# EAGLE design batsense (EAGLE 4.13)
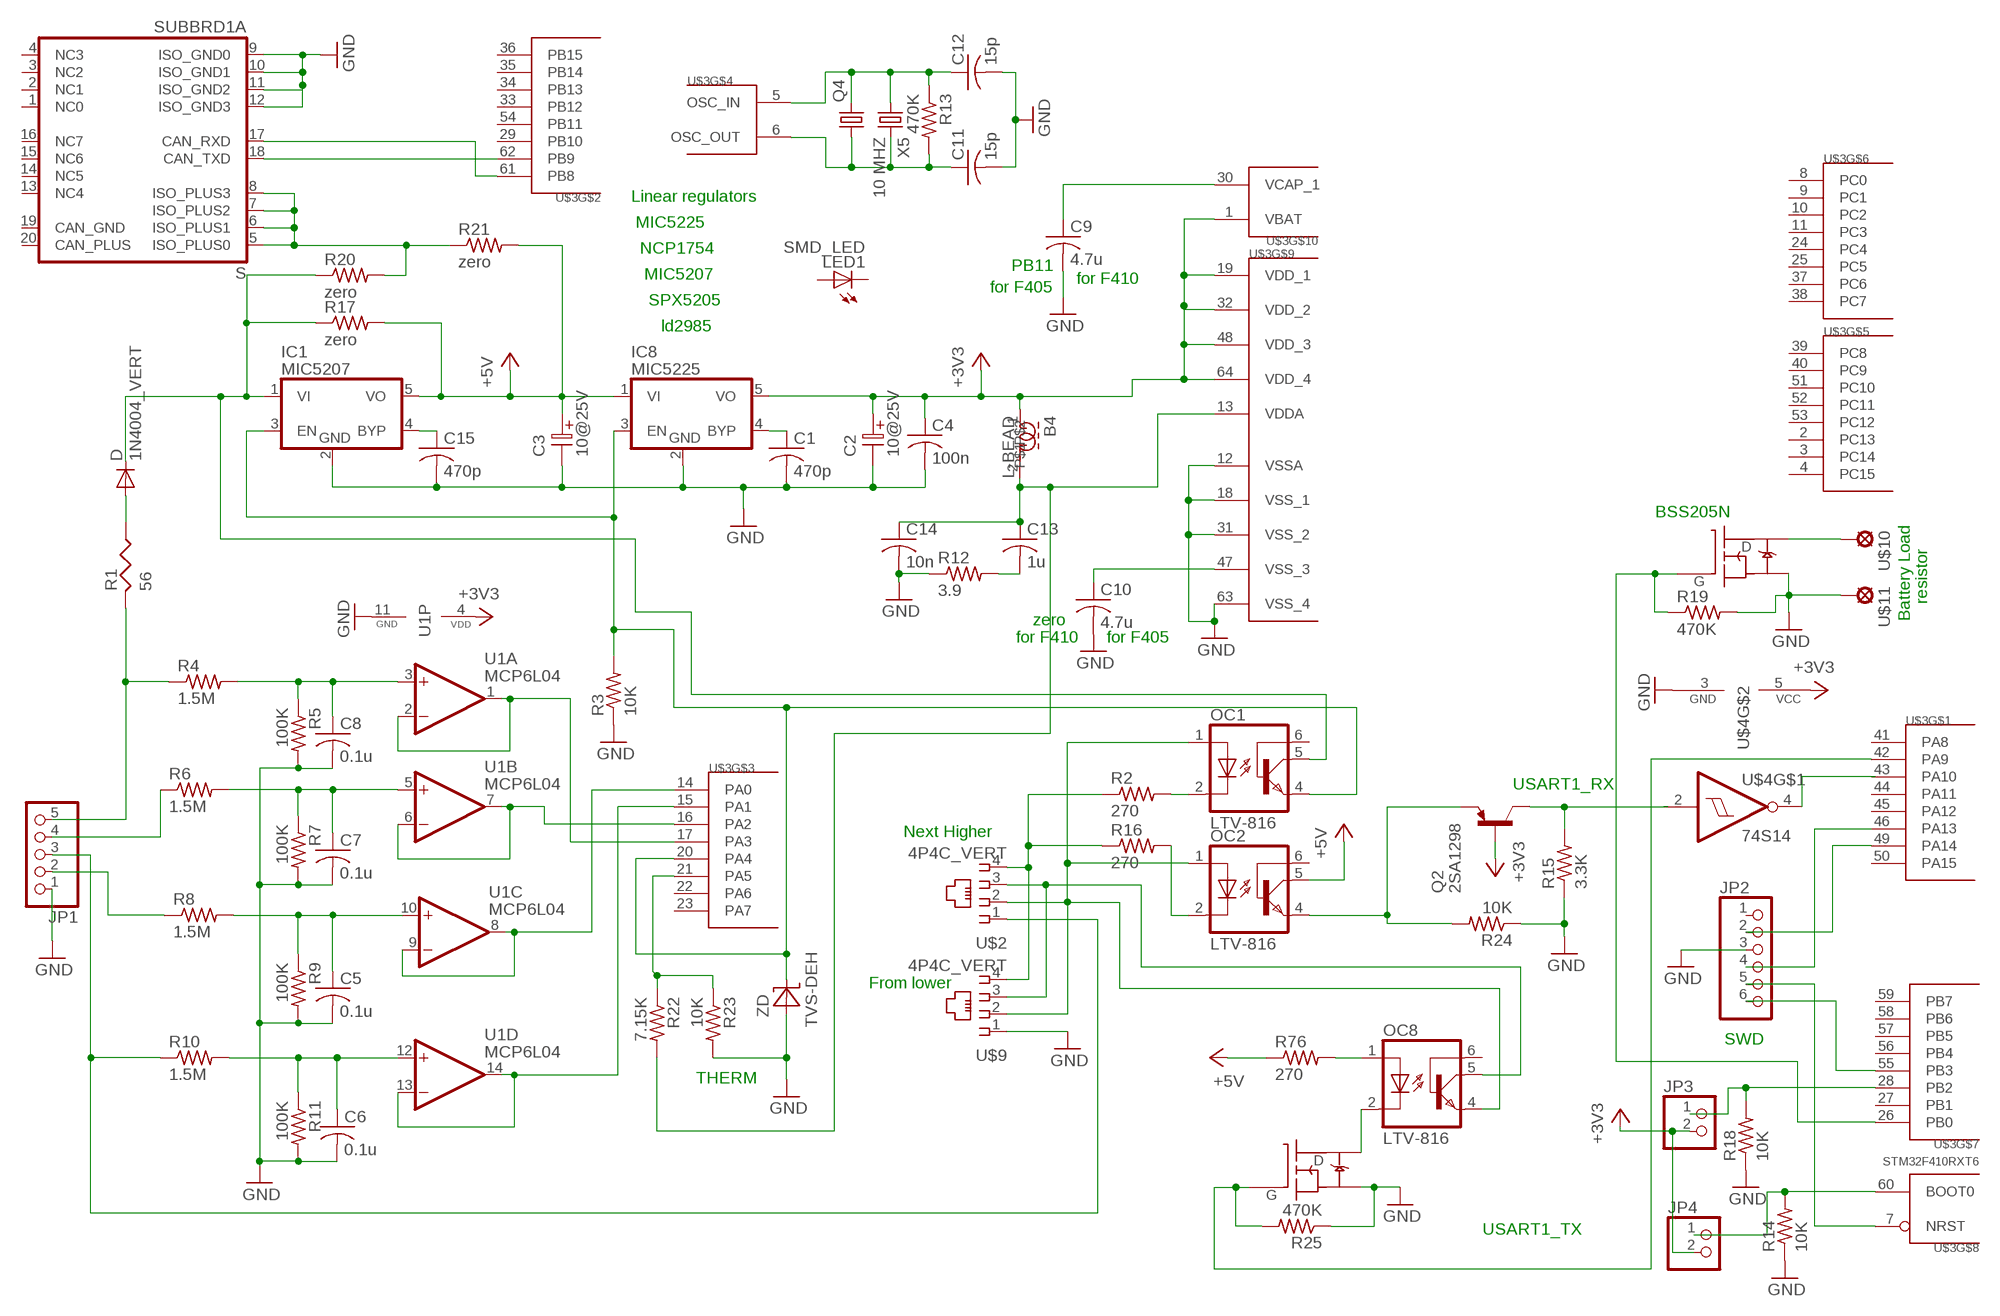
[diagram p0: schematic, sheet 1]

## Parts
B4  L-BEAD  [C0805]
C1  470p  C-USC0603  [C0603]
C2  10@25V  ELC-2,5L  [ES-2,5L]
C3  10@25V  ELC-2,5L  [ES-2,5L]
C4  100n  C-USC0603  [C0603]
C5  0.1u  C-USC0603  [C0603]
C6  0.1u  C-USC0603  [C0603]
C7  0.1u  C-USC0603  [C0603]
C8  0.1u  C-USC0603  [C0603]
C9  4.7u  C-USC0603  [C0603]
C10  4.7u  C-USC0603  [C0603]
C11  15p  C-USC0603  [C0603]
C12  15p  C-USC0603  [C0603]
C13  1u  C-USC0603  [C0603]
C14  10n  C-USC0603  [C0603]
C15  470p  C-USC0603  [C0603]
D  1N4004_VERT  [DO41-10_VERT]
IC1  MIC5207  MIC5205  [SOT-25]
IC8  MIC5225  MIC5205  [SOT-25]
JP1  PINHD-1X5  [1X05]
JP2  PINHD-1X6  [1X06]
JP3  PINHD-1X2  [1X02]
JP4  PINHD-1X2  [1X02]
LED1  SMD_LED  [SMD_LED]
OC1  LTV-816  4N35  [DIL06]
OC2  LTV-816  4N35  [DIL06]
OC8  LTV-816  4N35  [DIL06]
Q1  IRLML2060  [SOT-23]
Q2  2SA1298  BF823SMD  [SOT23-BEC]
Q4  CRYTALHC49U-V  [HC49U-V]
Q14  IRLML2060  [SOT-23]
R1  56  RESUS-S2,5  [RS-2,5]
R2  270  R-US_R0603  [R0603]
R3  10K  R-US_R0603  [R0603]
R4  1.5M  R-US_R0603  [R0603]
R5  100K  R-US_R0603  [R0603]
R6  1.5M  R-US_R0603  [R0603]
R7  100K  R-US_R0603  [R0603]
R8  1.5M  R-US_R0603  [R0603]
R9  100K  R-US_R0603  [R0603]
R10  1.5M  R-US_R0603  [R0603]
R11  100K  R-US_R0603  [R0603]
R12  3.9  R-US_R0603  [R0603]
R13  470K  R-US_R0603  [R0603]
R14  10K  R-US_R0603  [R0603]
R15  3.3K  R-US_R0603  [R0603]
R16  270  R-US_R0603  [R0603]
R17  zero  R-US_R0603  [R0603]
R18  10K  R-US_R0603  [R0603]
R19  470K  R-US_R0603  [R0603]
R20  zero  R-US_R0603  [R0603]
R21  zero  R-US_R0603  [R0603]
R22  7.15K  R-US_R0603  [R0603]
R23  10K  R-US_R0603  [R0603]
R24  10K  R-US_R0603  [R0603]
R25  470K  R-US_R0603  [R0603]
R76  270  R-US_R0603  [R0603]
S  SUBBRD1A  [SUBBRD1B]
U1  MCP6L04  TLC084T  [TSSOP14]
U$2  4P4C_VERT  [MOD4P4C_VERT]
U$3  STM32F410RXT6  [TQFP64]
U$4  74S14  [SOT-23]
U$9  4P4C_VERT  [MOD4P4C_VERT]
U$10  SOLPAD060  [SOLPAD060]
U$11  SOLPAD060  [SOLPAD060]
X5  10 MHZ  CRYTALHC49UP  [HC49UP]
ZD  TVS-DEH  [TVS-DEH]

## Nets
4WIRE_EN_LED: OC1.2(C) R2.2
4WIRE_PLUS: OC1.1(A) OC2.1(A) OC8.4(EMI) U$2.2 U$9.2
4WIRE_RCV: OC2.4(EMI) OC8.5(COL) Q2.E R24.2 U$2.3 U$9.3
4WIRE_XMIT: R2.1 R16.1 U$2.4 U$9.4
4WIRE_XMIT_USART: OC2.2(C) R16.2
5V_BYP: C15.1 IC1.4(BYP)
9_USART1_TX: Q14.1(G) R25.2 U$3.42(PA9)
+3V3: B4.1 C2.1 C4.1 IC8.5(VO) JP3.2 JP4.2 Q2.B U1.4(P:VDD) U$3.1(VBAT) U$3.19(VDD_1) U$3.32(VDD_2) U$3.48(VDD_3) U$3.64(VDD_4) U$4.5(VCC)
+5V: C3.1 IC1.5(VO) IC8.1(VI) OC2.5(COL) R17.2 R21.2 R76.1
+12V_RESISTORED: D.A R1.1
BATT_12V_X: JP1.4 R6.1
BATT_24V: JP1.2 R8.1
BATT_24V_X: JP1.3 R10.1 U$2.1
BATT_DIODED: D.C IC1.1(VI) OC1.5(COL) R17.1 R20.1
BOOT0: JP4.1 R14.2 U$3.60(BOOT0)
BOOT1: JP3.1 R18.2 U$3.28(PB2)
BYP: C1.1 IC8.4(BYP)
CAN1_RX: S.17(CAN_RXD) U$3.61(PB8)
CAN1_TX: S.18(CAN_TXD) U$3.62(PB9)
DIVIDER_12: C8.1 R4.2 R5.1 U1.3(A:+IN)
DIVIDER_12X: C7.1 R6.2 R7.1 U1.5(B:+IN)
DIVIDER_24: C5.1 R8.2 R9.1 U1.10(C:+IN)
DIVIDER_24X: C6.1 R10.2 R11.1 U1.12(D:+IN)
FET_XMIT: OC8.2(C) Q14.3(D)
GND: C1.2 C2.2 C3.2 C4.2 C5.2 C6.2 C7.2 C8.2 C9.2 C10.2 C11.2 C12.2 C14.2 C15.2 IC1.2(GND) IC8.2(GND) JP1.1 JP2.3 Q1.2(S) Q14.2(S) R3.1 R5.2 R7.2 R9.2 R11.2 R12.1 R14.1 R15.1 R18.1 R19.2 R23.2 R24.1 R25.1 S.9(ISO_GND0) S.10(ISO_GND1) S.11(ISO_GND2) S.12(ISO_GND3) U1.11(P:GND) U$3.12(VSSA) U$3.18(VSS_1) U$3.31(VSS_2) U$3.63(VSS_4) U$4.3(GND) U$9.1 U$11.MP ZD.A
N$1: JP1.5 R1.2 R4.1
N$2: Q1.1(G) R19.1 U$3.26(PB0)
N$3: Q1.3(D) U$10.MP
N$4: R22.1 R23.1 U$3.21(PA5)
N$7: C9.1 U$3.30(VCAP_1)
NRST: JP2.5 U$3.7(NRST)
PA0: U1.8(C:OUT) U1.9(C:-IN) U$3.14(PA0)
PA1: U1.13(D:-IN) U1.14(D:OUT) U$3.15(PA1)
PA2: U1.6(B:-IN) U1.7(B:OUT) U$3.16(PA2)
PA3: U1.1(A:OUT) U1.2(A:-IN) U$3.17(PA3)
PA4_EN: IC1.3(EN) IC8.3(EN) OC1.4(EMI) R3.2 U$3.20(PA4) ZD.C
PA10_USART1_RX: U$4.4(O)
PH0_OSC_IN_XTAL: C12.1 Q4.2 R13.1 U$3.5(OSC_IN) X5.1
PH1_OSC_OUT_XTAL: C11.1 Q4.1 R13.2 U$3.6(OSC_OUT) X5.2
RX_INVERTED: Q2.C R15.2 U$4.2(I)
SWCLK: JP2.2 U$3.49(PA14)
SWDIO: JP2.4 U$3.46(PA13)
SWITCHER_PWR: R20.2 R21.1 S.5(ISO_PLUS0) S.6(ISO_PLUS1) S.7(ISO_PLUS2) S.8(ISO_PLUS3)
SWO: JP2.6 U$3.55(PB3)
VCAP_2: C10.1 U$3.47(VSS_3)
VDDA: B4.2 C13.1 C14.1 R22.2 U$3.13(VDDA)
VDDA_DAMP: C13.2 R12.2
XMIT_R: OC8.1(A) R76.2
Unconnected: JP2.1 LED1.A LED1.C OC1.6(BAS) OC2.6(BAS) OC8.6(BAS) S.1(NC0) S.2(NC1) S.3(NC2) S.4(NC3) S.13(NC4) S.14(NC5) S.15(NC6) S.16(NC7) S.19(CAN_GND) S.20(CAN_PLUS) U$3.2(PC13) U$3.3(PC14) U$3.4(PC15) U$3.8(PC0) U$3.9(PC1) U$3.10(PC2) U$3.11(PC3) U$3.22(PA6) U$3.23(PA7) U$3.24(PC4) U$3.25(PC5) U$3.27(PB1) U$3.29(PB10) U$3.33(PB12) U$3.34(PB13) U$3.35(PB14) U$3.36(PB15) U$3.37(PC6) U$3.38(PC7) U$3.39(PC8) U$3.40(PC9) U$3.41(PA8) U$3.43(PA10) U$3.44(PA11) U$3.45(PA12) U$3.50(PA15) U$3.51(PC10) U$3.52(PC11) U$3.53(PC12) U$3.54(PB11) U$3.56(PB4) U$3.57(PB5) U$3.58(PB6) U$3.59(PB7)

## Notes on the sheet
- Linear regulators
- MIC5225
- NCP1754
- PB11
- MIC5207 | for F410
- for F405
- SPX5205
- ld2985
- BSS205N
- resistor
- zero | Battery Load
- for F410 | for F405
- USART1_RX
- Next Higher
- From lower
- SWD
- THERM
- USART1_TX

## Library data of the parts
B4 = rcl:L-BEAD
C1 C4-C15 = rcl:C-US: CAPACITOR, American symbol
C2 C3 = DEH:ELC-2,5L
D = diode:1N4004_VERT
IC1 IC8 = linear:MIC5205
JP1 = pinhead:PINHD-1X5: PIN HEADER
JP2 = pinhead:PINHD-1X6: PIN HEADER
JP3 JP4 = pinhead:PINHD-1X2: PIN HEADER
LED1 = led:SMD_LED
OC1 OC2 OC8 = optocoupler:4N35: MOTOROLA OPTO COUPLER
Q1 Q14 = transistor-fet:IRLML2060
Q2 = transistor-pnp:BF823*: PNP Transistror
Q4 X5 = crystal:CRYTAL: CRYSTAL
R1 = DEH:RESUS-S2,5
R2-R25 R76 = rcl:R-US_: RESISTOR, American symbol
S = dc-dc-converter:SUBBRD1A
U1 = op-amp:TLC084: BiMOS OP-AMP Single Supply
U$2 U$9 = DEH:4P4C_VERT
U$3 = stm32:STM32F410RXT6
U$4 = 74xx-us:74S14
U$10 U$11 = solpad:SOLPAD060
ZD = diode-1:TVS-DEH

## Board
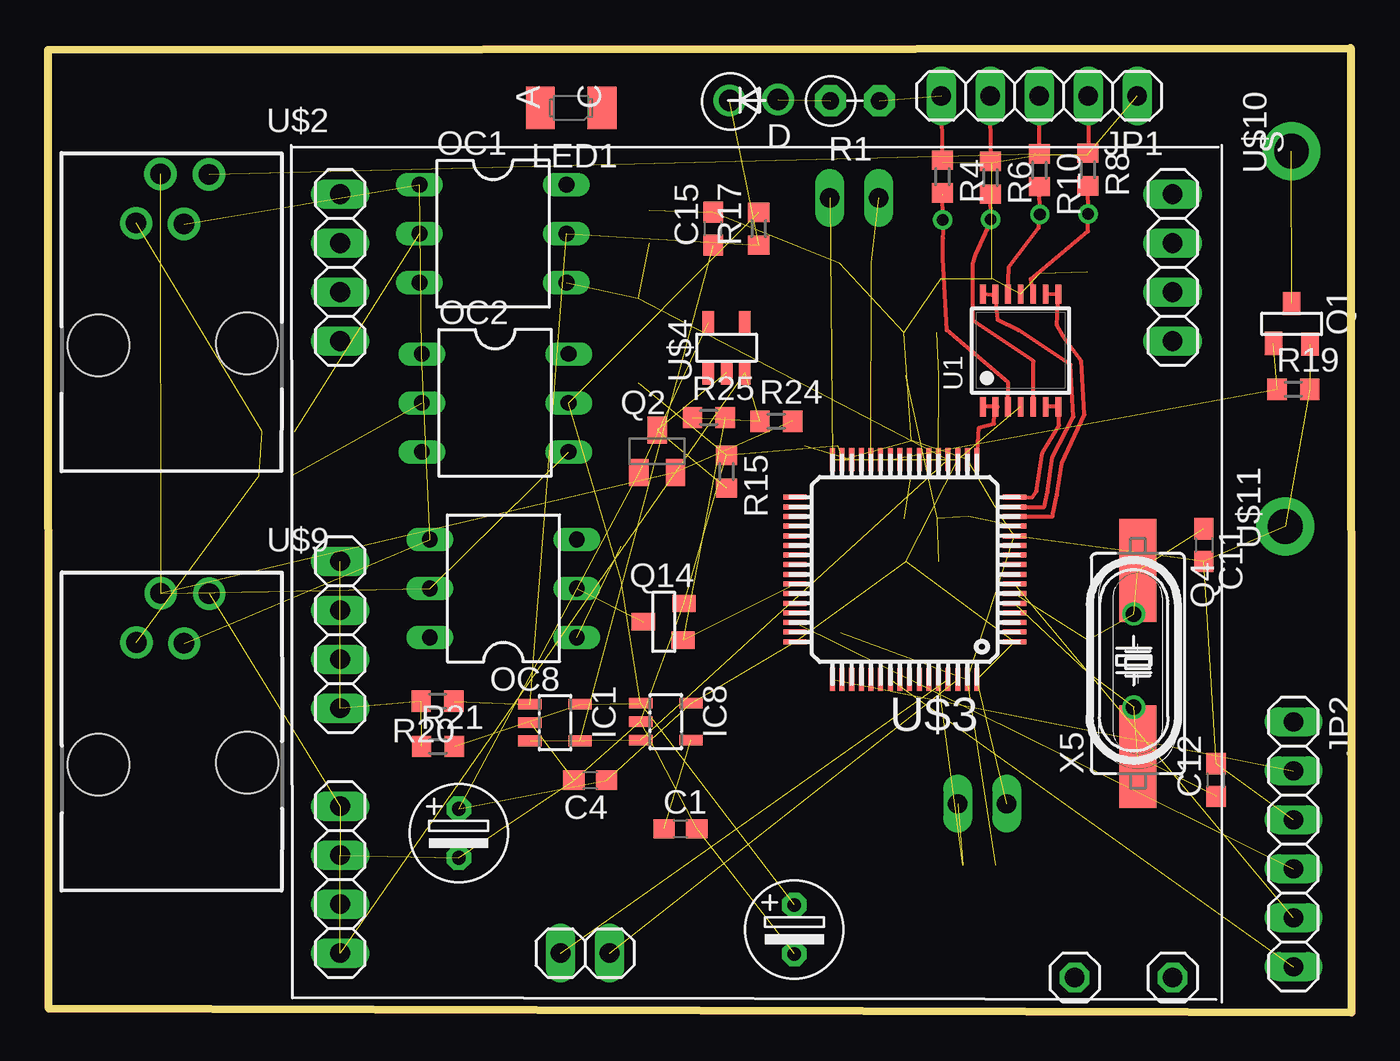
[diagram p1: board, top side]
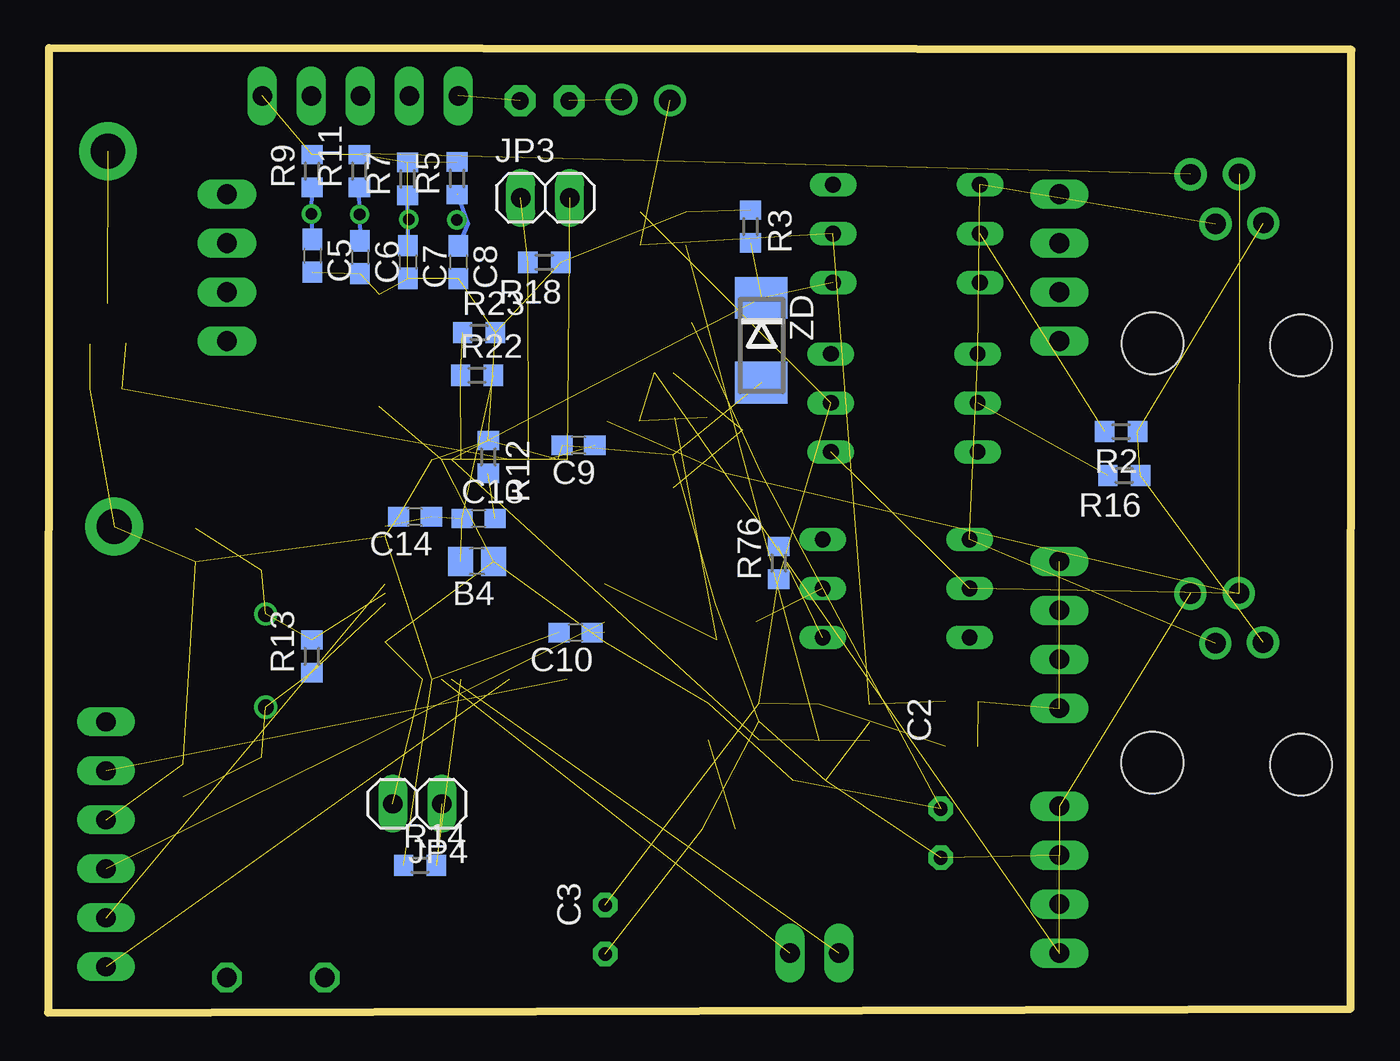
[diagram p2: board, bottom side, seen from below]

Size 67.58 x 50.02 mm. Coordinates in mm from the lower left corner, seen from the top.
Outline: 0.03,0.2 0.03,0.21
Outline: 0.03,0.21 0,49.94 67.54,50.02 67.58,0 0.03,0.21
Copper layers (1*16): Top 0.035mm / dielectric 1.5mm / Bottom 0.035mm
Design rules "default": minimum track width 8mil, minimum drill 0.6mm, track to track 8mil, track to pad 8mil, pad to pad 8mil, via to via 8mil, smd to smd 0mil, copper to edge 8mil, drill to drill 8mil, minimum pad ring 8mil, minimum via ring 8mil, stop-mask expansion 4mil, vias tented up to drill 0mil, thermal gap 10mil

### Footprints (pad centres in the part's own frame; a part is rotated, then mirrored left to right if it is on the bottom)
C0805 = smd 1.3 x 1.5: 1 -0.85,0; 2 0.85,0
C0603 = smd 1.1 x 1: 1 -0.85,0; 2 0.85,0
ES-2,5L = drill 0.711 pad 1.27 octagon: 1 0,0; 2 2.54,0
DO41-10_VERT = drill 1.1 round: A 2.58,0.05; C 0.07,0
SOT-25 = smd 0.55 x 1.2: 1 -0.95,-1.3; 2 0,-1.3; 3 0.95,-1.3; 4 0.95,1.3; 5 -0.95,1.3
1X05 = drill 1.016 long: 1 -5.08,0; 2 -2.54,0; 3 0,0; 4 2.54,0; 5 5.08,0
1X06 = drill 1 long: 1 -6.35,0; 2 -3.81,0; 3 -1.27,0; 4 1.27,0; 5 3.81,0; 6 6.35,0
1X02 = drill 1 long: 1 -1.27,0; 2 1.27,0
SMD_LED = smd 2.2 x 1.5: A 0,1.6; C 0,-1.6
DIL06 = drill 0.813 long: 1 -2.54,-3.81; 2 0,-3.81; 3 2.54,-3.81; 4 2.54,3.81; 5 0,3.81; 6 -2.54,3.81
SOT-23 = smd 0.9 x 1.2: 1 -1,-1.006; 2 0.9,-1.056; 3 -0.05,1.056
SOT23-BEC = smd 1 x 1.4: B -0.95,-1.1; C 0,1.1; E 0.95,-1.1
HC49U-V = drill 0.8 round: 1 -2.413,0; 2 2.413,0
RS-2,5 = drill 0.9 pad 1.6 octagon: 1 0,0; 2 2.54,0
R0603 = smd 1 x 1.1: 1 -0.85,0; 2 0.85,0
SUBBRD1B = drill 1.016 long: 1 2.54,2.54; 2 5.08,2.54; 3 7.62,2.54; 4 10.16,2.54; 5 21.59,2.54; 6 24.13,2.54; 7 26.67,2.54; 8 29.21,2.54; 9 34.29,2.54; 10 36.83,2.54; 11 39.37,2.54; 12 41.91,2.54; 13 2.54,45.72; 14 5.08,45.72; 15 7.62,45.72; 16 10.16,45.72; 17 41.91,13.97; 18 41.91,16.51 | drill 1.016 octagon: 19 43.18,45.72; 20 43.18,40.64
TSSOP14 = smd 0.305 x 0.991: 1 -1.95,-2.918; 2 -1.3,-2.918; 3 -0.65,-2.918; 4 0,-2.918; 5 0.65,-2.918; 6 1.3,-2.918; 7 1.95,-2.918; 8 1.95,2.918; 9 1.3,2.918; 10 0.65,2.918; 11 0,2.918; 12 -0.65,2.918; 13 -1.3,2.918; 14 -1.95,2.918
MOD4P4C_VERT = drill 1.067 pad 1.676 round: 1 1.89,8.86; 2 0.59,6.28; 3 -0.63,8.88; 4 -1.89,6.33 | hole 3.2: -3.85,-0.01; 3.86,0.1
TQFP64 = smd 1.2 x 0.26: 1 -5.7,3.75; 2 -5.7,3.25; 3 -5.7,2.75; 4 -5.7,2.25; 5 -5.7,1.75; 6 -5.7,1.25; 7 -5.7,0.75; 8 -5.7,0.25; 9 -5.7,-0.25; 10 -5.7,-0.75; 11 -5.7,-1.25; 12 -5.7,-1.75; 13 -5.7,-2.25; 14 -5.7,-2.75; 15 -5.7,-3.25; 16 -5.7,-3.75; 33 5.7,-3.75; 34 5.7,-3.25; 35 5.7,-2.75; 36 5.7,-2.25; 37 5.7,-1.75; 38 5.7,-1.25; 39 5.7,-0.75; 40 5.7,-0.25; 41 5.7,0.25; 42 5.7,0.75; 43 5.7,1.25; 44 5.7,1.75; 45 5.7,2.25; 46 5.7,2.75; 47 5.7,3.25; 48 5.7,3.75 | smd 0.26 x 1.2: 17 -3.75,-5.7; 18 -3.25,-5.7; 19 -2.75,-5.7; 20 -2.25,-5.7; 21 -1.75,-5.7; 22 -1.25,-5.7; 23 -0.75,-5.7; 24 -0.25,-5.7; 25 0.25,-5.7; 26 0.75,-5.7; 27 1.25,-5.7; 28 1.75,-5.7; 29 2.25,-5.7; 30 2.75,-5.7; 31 3.25,-5.7; 32 3.75,-5.7; 49 3.75,5.7; 50 3.25,5.7; 51 2.75,5.7; 52 2.25,5.7; 53 1.75,5.7; 54 1.25,5.7; 55 0.75,5.7; 56 0.25,5.7; 57 -0.25,5.7; 58 -0.75,5.7; 59 -1.25,5.7; 60 -1.75,5.7; 61 -2.25,5.7; 62 -2.75,5.7; 63 -3.25,5.7; 64 -3.75,5.7
SOT-23' = smd 0.6 x 1.2: 1 -0.95,-1.306; 2 0,-1.306; 3 0.95,-1.306; 4 0.95,1.306; 5 -0.95,1.306
SOLPAD060 = drill 1.8 pad 3 round: MP 0,0
HC49UP = smd 5.334 x 1.93: 1 -4.826,0; 2 4.826,0
TVS-DEH = smd 2.16 x 2.7: A 2.19,-0.05; C -2.2,-0.05

### Placement (x,y rotation side)
B4  45.34,23.4 180 bottom
C1  32.79,9.53 0 top
C2  21.29,10.57 270 top
C3  38.7,5.58 270 top
C4  28.11,12.05 180 top
C5  53.88,39.25 270 bottom
C6  51.41,39.18 270 bottom
C7  48.93,38.93 270 bottom
C8  46.31,38.92 270 bottom
C9  40.08,29.42 180 bottom
C10  40.23,19.71 180 bottom
C11  59.93,24.25 270 top
C12  60.57,12.06 90 top
C13  45.26,25.63 0 bottom
C14  48.56,25.72 180 bottom
C15  34.49,40.66 90 top
D  35.27,47.31 0 top
IC1  26.28,15.04 270 top
IC8  32.03,15.09 270 top
JP1  51.4,47.55 180 top
JP2  64.58,8.73 270 top
JP3  41.8,42.26 0 bottom
JP4  48.44,10.83 180 bottom
LED1  27.12,46.92 90 top
OC1  23.07,40.4 270 top
OC2  23.18,31.62 270 top
OC8  23.61,22 90 top
Q1  64.54,35.72 0 top
Q2  31.58,29.11 0 top
Q4  56.3,18.26 270 top
Q14  31.92,20.32 90 top
R1  40.57,47.29 0 top
R2  11.94,30.13 180 bottom
R3  31.16,40.77 270 bottom
R4  46.37,43.36 270 top
R5  46.38,43.27 90 bottom
R6  48.86,43.3 270 top
R7  48.94,43.24 90 bottom
R8  53.92,43.72 270 top
R9  53.89,43.65 90 bottom
R10  51.4,43.69 270 top
R11  51.44,43.65 90 bottom
R12  44.76,28.82 270 bottom
R13  53.91,18.48 90 bottom
R14  48.3,7.64 0 bottom
R15  35.18,28.06 270 top
R16  11.78,27.85 180 bottom
R17  36.85,40.66 90 top
R18  41.85,38.91 180 bottom
R19  64.58,32.33 0 top
R20  20.19,16.15 180 top
R21  20.21,13.8 0 top
R22  45.34,33.05 0 bottom
R23  45.24,35.27 0 bottom
R24  37.76,30.67 0 top
R25  34.26,30.86 0 top
R76  29.7,23.32 90 bottom
S  12.6,44.99 270 top
U1  50.43,34.34 0 top
U$2  6.45,34.62 0 top
U$3  44.42,22.98 180 top
U$4  74S14  [SOT-23']  35.18,34.49 0 top
U$9  6.46,12.87 0 top
U$10  64.48,44.68 90 top
U$11  64.16,25.21 90 top
X5  56.51,18.1 90 top
ZD  30.55,34.87 270 bottom

### Tracks (layer width: path | path; a pad name or v marks a point on that pad's centre or on a via)
4WIRE_EN_LED  (1 unrouted)
4WIRE_PLUS  (4 unrouted)
4WIRE_RCV  (5 unrouted)
4WIRE_XMIT  (3 unrouted)
4WIRE_XMIT_USART  (1 unrouted)
5V_BYP  (1 unrouted)
9_USART1_TX  (2 unrouted)
+3V3  (13 unrouted)
+5V  (6 unrouted)
+12V_RESISTORED  (1 unrouted)
BATT_12V_X
  Top 0.203: R6.1 48.88,44.15 JP1.4
BATT_24V
  Top 0.203: 53.8,44.54 R8.1 53.98,44.49 JP1.2
BATT_24V_X  (1 unrouted)
  Top 0.203: 51.4,44.49 R10.1 JP1.3
BATT_DIODED  (4 unrouted)
BOOT0  (2 unrouted)
BOOT1  (2 unrouted)
BYP  (1 unrouted)
CAN1_RX  (1 unrouted)
CAN1_TX  (1 unrouted)
DIVIDER_12  (via drill 0.6)  (1 unrouted)
  Top 0.203: R4.2 v46.39,41.12 46.47,41.24 46.41,40.15 46.4,39.1 46.6,35.39 49.79,32.67 U1.3
  Bottom 0.203: 45.81,40.95 C8.1 | 45.81,40.95 46.32,42.41 46.35,42.44 | 45.81,40.95 46.42,41.26 v46.39,41.12
DIVIDER_12X  (via drill 0.6)
  Top 0.203: R6.2 v48.88,41.14 48.96,41.22 48.11,39.34 47.95,38.84 47.95,35.88 51.1,33.78 U1.5
  Bottom 0.203: C7.1 48.93,39.83 48.94,41.07 | 48.94,41.07 R7.1 | 48.94,41.07 48.93,41.07 v48.88,41.14
DIVIDER_24  (via drill 0.6)
  Top 0.203: R8.2 v53.94,41.43 53.91,41.48 53.92,40.53 50.95,38.05 U1.10
  Bottom 0.203: C5.1 53.92,40.21 53.91,41.4 | 53.91,41.4 R9.1 | 53.91,41.4 53.99,41.4 v53.94,41.43
DIVIDER_24X  (via drill 0.6)
  Top 0.203: R10.2 v51.43,41.41 51.44,41.48 51.37,40.7 49.81,38.66 U1.12
  Bottom 0.203: R11.1 51.45,42.82 51.43,41.36 | 51.43,41.36 C6.1 | 51.43,41.36 v51.43,41.41
FET_XMIT  (1 unrouted)
GND  (45 unrouted)
N$1  (1 unrouted)
  Top 0.203: R4.1 46.4,44.13 JP1.5
N$2  (2 unrouted)
N$3  (1 unrouted)
N$4  (2 unrouted)
N$7  (1 unrouted)
NRST  (1 unrouted)
PA0
  Top 0.203: U$3.14 52.08,25.74 52.32,26.84 52.56,28.5 53.74,31.01 53.57,33.81 52.63,35.09 52.32,35.64 U1.8 52.29,37.23 U1.9
PA1
  Top 0.203: U$3.15 51.66,26.23 51.83,26.98 52.07,28.81 53.17,30.91 53.02,33.6 50.32,35.39 49.24,35.92 U1.13 48.94,37.22 U1.14
PA2
  Top 0.203: U$3.16 51.04,26.72 51.25,27.03 51.56,29.04 52.42,30.45 52.38,31.55 U1.7 52.42,31.43 U1.6
PA3
  Top 0.203: U$3.17 48.27,30.34 49.05,30.54 49.1,31.52 U1.2 49.24,31.43 U1.1
PA4_EN  (5 unrouted)
PH0_OSC_IN_XTAL  (4 unrouted)
PH1_OSC_OUT_XTAL  (4 unrouted)
RX_INVERTED  (2 unrouted)
SWCLK  (1 unrouted)
SWDIO  (1 unrouted)
SWITCHER_PWR  (5 unrouted)
SWO  (1 unrouted)
VCAP_2  (1 unrouted)
VDDA  (4 unrouted)
VDDA_DAMP  (1 unrouted)
XMIT_R  (1 unrouted)